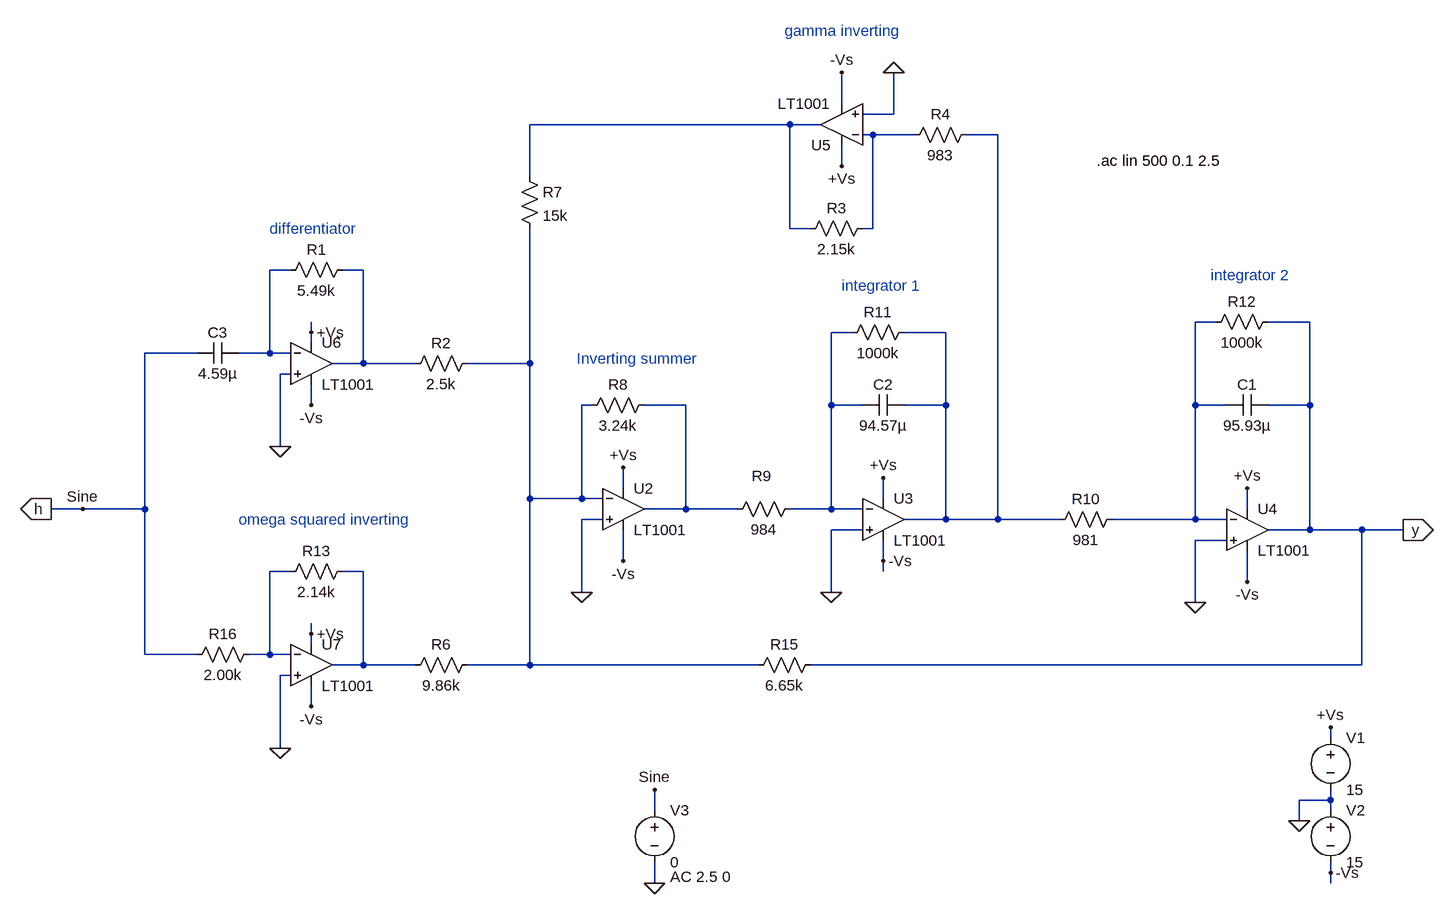
[diagram p0: schematic LTspice Terrain Bode.asc]
LTspice Terrain Bode.asc, the LTspice schematic file:
Version 4
SHEET 1 1420 1044
WIRE 320 -336 320 -384
WIRE 400 -320 400 -384
WIRE 400 -320 352 -320
WIRE 240 -304 -160 -304
WIRE 288 -304 240 -304
WIRE 368 -288 352 -288
WIRE 432 -288 368 -288
WIRE 560 -288 512 -288
WIRE 320 -240 320 -272
WIRE -160 -224 -160 -304
WIRE 240 -144 240 -304
WIRE 272 -144 240 -144
WIRE 368 -144 368 -288
WIRE 368 -144 352 -144
WIRE -528 -80 -560 -80
WIRE -416 -80 -448 -80
WIRE 896 0 864 0
WIRE 1040 0 976 0
WIRE -496 16 -496 0
WIRE 336 16 304 16
WIRE 480 16 416 16
WIRE -496 32 -496 16
WIRE -672 48 -752 48
WIRE -560 48 -560 -80
WIRE -560 48 -608 48
WIRE -528 48 -560 48
WIRE -416 64 -416 -80
WIRE -416 64 -464 64
WIRE -336 64 -416 64
WIRE -160 64 -160 -144
WIRE -160 64 -256 64
WIRE -528 80 -544 80
WIRE -496 128 -496 96
WIRE -64 128 -80 128
WIRE 80 128 16 128
WIRE 304 128 304 16
WIRE 352 128 304 128
WIRE 480 128 480 16
WIRE 480 128 416 128
WIRE 864 128 864 0
WIRE 912 128 864 128
WIRE 1040 128 1040 0
WIRE 1040 128 976 128
WIRE -544 192 -544 80
WIRE -16 256 -16 224
WIRE -160 272 -160 64
WIRE -80 272 -80 128
WIRE -80 272 -160 272
WIRE -48 272 -80 272
WIRE 384 272 384 240
WIRE -848 288 -896 288
WIRE -752 288 -752 48
WIRE -752 288 -848 288
WIRE 80 288 80 128
WIRE 80 288 16 288
WIRE 160 288 80 288
WIRE 304 288 304 128
WIRE 304 288 240 288
WIRE 352 288 304 288
WIRE 944 288 944 256
WIRE -48 304 -80 304
WIRE 480 304 480 128
WIRE 480 304 416 304
WIRE 560 304 560 -288
WIRE 560 304 480 304
WIRE 656 304 560 304
WIRE 864 304 864 128
WIRE 864 304 736 304
WIRE 912 304 864 304
WIRE 352 320 304 320
WIRE 1040 320 1040 128
WIRE 1040 320 976 320
WIRE 1120 320 1040 320
WIRE 1184 320 1120 320
WIRE 912 336 864 336
WIRE -16 368 -16 320
WIRE 384 368 384 336
WIRE -528 384 -560 384
WIRE -416 384 -448 384
WIRE 384 384 384 368
WIRE 944 400 944 352
WIRE -80 416 -80 304
WIRE 304 416 304 320
WIRE 864 432 864 336
WIRE -496 480 -496 464
WIRE -496 496 -496 480
WIRE -752 512 -752 288
WIRE -672 512 -752 512
WIRE -560 512 -560 384
WIRE -560 512 -592 512
WIRE -528 512 -560 512
WIRE -416 528 -416 384
WIRE -416 528 -464 528
WIRE -336 528 -416 528
WIRE -160 528 -160 272
WIRE -160 528 -256 528
WIRE 192 528 -160 528
WIRE 1120 528 1120 320
WIRE 1120 528 272 528
WIRE -528 544 -544 544
WIRE -496 592 -496 560
WIRE 1072 640 1072 624
WIRE -544 656 -544 544
WIRE 1072 736 1072 720
WIRE 1072 736 1024 736
WIRE 32 752 32 720
WIRE 1072 752 1072 736
WIRE 1024 768 1024 736
WIRE 1072 848 1072 832
WIRE 32 864 32 832
WIRE 1072 864 1072 848
FLAG 400 -384 0
FLAG -80 416 0
FLAG 304 416 0
FLAG 864 432 0
FLAG 1184 320 y
IOPIN 1184 320 Out
FLAG -16 224 +Vs
FLAG -16 368 -Vs
FLAG 384 240 +Vs
FLAG 384 368 -Vs
FLAG 320 -240 +Vs
FLAG 320 -384 -Vs
FLAG 944 256 +Vs
FLAG 944 400 -Vs
FLAG 1072 624 +Vs
FLAG 1072 848 -Vs
FLAG 1024 768 0
FLAG -544 656 0
FLAG -496 480 +Vs
FLAG -496 592 -Vs
FLAG 32 864 0
FLAG 32 720 Sine
FLAG -896 288 h
IOPIN -896 288 Out
FLAG -544 192 0
FLAG -496 16 +Vs
FLAG -496 128 -Vs
FLAG -848 288 Sine
SYMBOL res 368 -160 R90
WINDOW 0 0 56 VBottom 2
WINDOW 3 32 56 VTop 2
SYMATTR InstName R3
SYMATTR Value 2.15k
SYMBOL res 528 -304 R90
WINDOW 0 0 56 VBottom 2
WINDOW 3 32 56 VTop 2
SYMATTR InstName R4
SYMATTR Value 983
SYMBOL res -240 512 R90
WINDOW 0 0 56 VBottom 2
WINDOW 3 32 56 VTop 2
SYMATTR InstName R6
SYMATTR Value 9.86k
SYMBOL res -176 -240 R0
SYMATTR InstName R7
SYMATTR Value 15k
SYMBOL res 32 112 R90
WINDOW 0 0 56 VBottom 2
WINDOW 3 32 56 VTop 2
SYMATTR InstName R8
SYMATTR Value 3.24k
SYMBOL res 256 272 R90
WINDOW 0 -19 59 VBottom 2
WINDOW 3 32 56 VTop 2
SYMATTR InstName R9
SYMATTR Value 984
SYMBOL res 752 288 R90
WINDOW 0 0 56 VBottom 2
WINDOW 3 32 56 VTop 2
SYMATTR InstName R10
SYMATTR Value 981
SYMBOL cap 976 112 R90
WINDOW 0 0 32 VBottom 2
WINDOW 3 32 32 VTop 2
SYMATTR InstName C1
SYMATTR Value 95.93µ
SYMBOL OpAmps/LT1001 -16 224 R0
SYMATTR InstName U2
SYMBOL OpAmps/LT1001 384 240 R0
SYMATTR InstName U3
SYMBOL OpAmps/LT1001 944 256 R0
SYMATTR InstName U4
SYMBOL OpAmps/LT1001 320 -240 R180
SYMATTR InstName U5
SYMBOL cap 416 112 R90
WINDOW 0 0 32 VBottom 2
WINDOW 3 32 32 VTop 2
SYMATTR InstName C2
SYMATTR Value 94.57µ
SYMBOL res 432 0 R90
WINDOW 0 0 56 VBottom 2
WINDOW 3 32 56 VTop 2
SYMATTR InstName R11
SYMATTR Value 1000k
SYMBOL res 992 -16 R90
WINDOW 0 0 56 VBottom 2
WINDOW 3 32 56 VTop 2
SYMATTR InstName R12
SYMATTR Value 1000k
SYMBOL voltage 1072 624 R0
SYMATTR InstName V1
SYMATTR Value 15
SYMBOL voltage 1072 736 R0
SYMATTR InstName V2
SYMATTR Value 15
SYMBOL res -544 400 R270
WINDOW 0 32 56 VTop 2
WINDOW 3 0 56 VBottom 2
SYMATTR InstName R13
SYMATTR Value 2.14k
SYMBOL res -576 496 R90
WINDOW 0 0 56 VBottom 2
WINDOW 3 32 56 VTop 2
SYMATTR InstName R16
SYMATTR Value 2.00k
SYMBOL OpAmps/LT1001 -496 464 R0
SYMATTR InstName U7
SYMBOL res 288 512 R90
WINDOW 0 0 56 VBottom 2
WINDOW 3 32 56 VTop 2
SYMATTR InstName R15
SYMATTR Value 6.65k
SYMBOL voltage 32 736 R0
WINDOW 123 24 118 Left 2
SYMATTR Value2 AC 2.5 0
SYMATTR InstName V3
SYMATTR Value 0
SYMBOL OpAmps/LT1001 -496 0 R0
SYMATTR InstName U6
SYMBOL cap -608 32 R90
WINDOW 0 0 32 VBottom 2
WINDOW 3 32 32 VTop 2
SYMATTR InstName C3
SYMATTR Value 4.59µ
SYMBOL res -544 -64 R270
WINDOW 0 32 56 VTop 2
WINDOW 3 0 56 VBottom 2
SYMATTR InstName R1
SYMATTR Value 5.49k
SYMBOL res -240 48 R90
WINDOW 0 0 56 VBottom 2
WINDOW 3 32 56 VTop 2
SYMATTR InstName R2
SYMATTR Value 2.5k
TEXT -608 304 Left 2 ;omega squared inverting
TEXT 232 -448 Left 2 ;gamma inverting
TEXT -88 56 Left 2 ;Inverting summer
TEXT 320 -56 Left 2 ;integrator 1
TEXT 888 -72 Left 2 ;integrator 2
TEXT -560 -144 Left 2 ;differentiator
TEXT 712 -248 Left 2 !.ac lin 500 0.1 2.5

The netlist it stands for:
* LTspice Terrain Bode.asc
R3 N002 N001 2.15k
R4 N003 N002 983
R6 N008 N011 9.86k
R7 N001 N008 15k
R8 N009 N008 3.24k
R9 N007 N009 984
R10 N006 N003 981
C1 y N006 95.93µ
XU2 0 N008 +Vs -Vs N009 LT1001  ; pins In+ In- V+ V- OUT
XU3 0 N007 +Vs -Vs N003 LT1001  ; pins In+ In- V+ V- OUT
XU4 0 N006 +Vs -Vs y LT1001  ; pins In+ In- V+ V- OUT
XU5 0 N002 +Vs -Vs N001 LT1001  ; pins In+ In- V+ V- OUT
C2 N003 N007 94.57µ
R11 N003 N007 1000k
R12 y N006 1000k
V1 +Vs 0 15
V2 0 -Vs 15
R13 N010 N011 2.14k
R16 N010 h 2.00k
XU7 0 N010 +Vs -Vs N011 LT1001  ; pins In+ In- V+ V- OUT
R15 y N008 6.65k
V3 h 0 0 AC 2.5 0
XU6 0 N004 +Vs -Vs N005 LT1001  ; pins In+ In- V+ V- OUT
C3 N004 h 4.59µ
R1 N004 N005 5.49k
R2 N008 N005 2.5k
* omega squared inverting
* gamma inverting
* Inverting summer
* integrator 1
* integrator 2
* differentiator
.ac lin 500 0.1 2.5
.lib LTC.lib
.backanno
.end